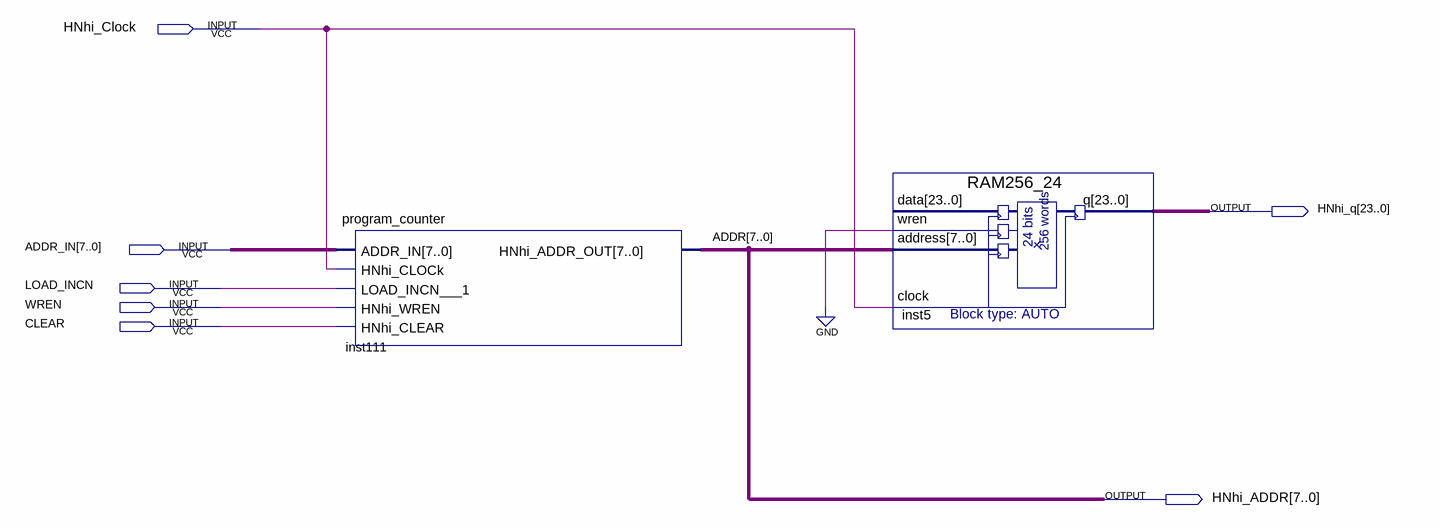
[diagram p0: schematic sheet]
// Quartus schematic Assignment3.bdf as structural Verilog: 2 symbols, 7 pins
module Assignment3 (
  input  HNhi_Clock,
  input  [7:0] ADDR_IN,
  input  LOAD_INCN,
  input  WREN,
  input  CLEAR,
  output [23:0] HNhi_q,
  output [7:0] HNhi_ADDR
);

  program_counter inst111 (
    .ADDR_IN(ADDR_IN), .HNhi_CLOCk(HNhi_Clock), .LOAD_INCN___1(LOAD_INCN), .HNhi_WREN(WREN),
    .HNhi_CLEAR(CLEAR), .HNhi_ADDR_OUT(HNhi_ADDR));
  RAM256_24 inst5 (.wren(1'b0), .address(HNhi_ADDR), .clock(HNhi_Clock), .q(HNhi_q));  // open: data

  // Other names for the same wires on the sheet: ADDR[7:0] = HNhi_ADDR
endmodule
